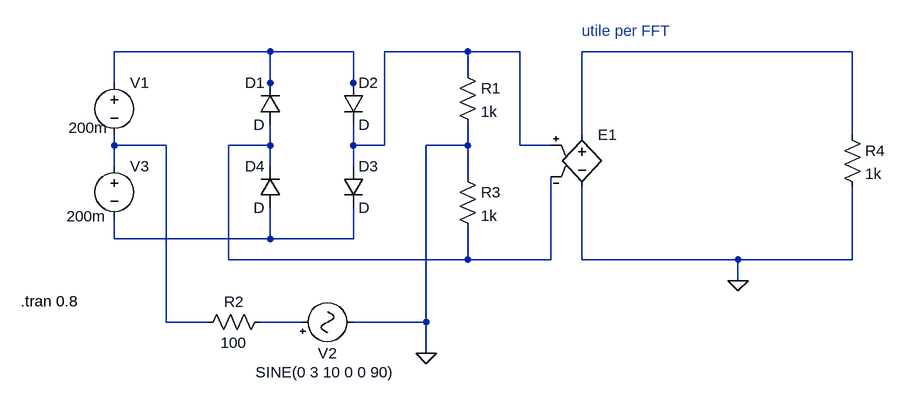
[diagram p0: schematic mod_anello_dopp_basic.asc]
mod_anello_dopp_basic.asc, the LTspice schematic file:
Version 4
SHEET 1 1172 680
WIRE 208 -48 -32 -48
WIRE 336 -48 208 -48
WIRE 512 -48 384 -48
WIRE 592 -48 512 -48
WIRE 1104 -48 688 -48
WIRE 512 -16 512 -48
WIRE -32 0 -32 -48
WIRE 208 0 208 -48
WIRE 336 0 336 -48
WIRE 208 16 208 0
WIRE 336 16 336 0
WIRE 688 80 688 -48
WIRE 1104 80 1104 -48
WIRE -32 96 -32 80
WIRE 48 96 -32 96
WIRE 208 96 208 64
WIRE 208 96 144 96
WIRE 336 96 336 64
WIRE 384 96 384 -48
WIRE 384 96 336 96
WIRE 512 96 512 64
WIRE 512 96 448 96
WIRE 592 96 592 -48
WIRE 640 96 592 96
WIRE -32 128 -32 96
WIRE 208 128 208 96
WIRE 336 128 336 96
WIRE 512 144 512 96
WIRE -32 240 -32 208
WIRE 208 240 208 192
WIRE 208 240 -32 240
WIRE 336 240 336 192
WIRE 336 240 208 240
WIRE 144 272 144 96
WIRE 512 272 512 224
WIRE 512 272 144 272
WIRE 640 272 640 144
WIRE 640 272 512 272
WIRE 688 272 688 160
WIRE 928 272 688 272
WIRE 1104 272 1104 160
WIRE 1104 272 928 272
WIRE 928 304 928 272
WIRE 48 368 48 96
WIRE 112 368 48 368
WIRE 256 368 192 368
WIRE 448 368 448 96
WIRE 448 368 336 368
WIRE 448 416 448 368
FLAG 448 416 0
FLAG 928 304 0
SYMBOL voltage -32 -16 R0
WINDOW 123 0 0 Left 2
WINDOW 39 -70 113 Left 2
WINDOW 3 -70 85 Left 2
SYMATTR Value 200m
SYMATTR InstName V1
SYMBOL diode 224 64 R180
WINDOW 0 24 64 Left 2
WINDOW 3 24 0 Left 2
SYMATTR InstName D1
SYMBOL diode 320 0 R0
SYMATTR InstName D2
SYMBOL diode 320 128 R0
SYMATTR InstName D3
SYMBOL diode 224 192 R180
WINDOW 0 24 64 Left 2
WINDOW 3 24 0 Left 2
SYMATTR InstName D4
SYMBOL res 208 352 R90
WINDOW 0 0 56 VBottom 2
WINDOW 3 32 56 VTop 2
SYMATTR InstName R2
SYMATTR Value 100
SYMBOL res 496 128 R0
SYMATTR InstName R3
SYMATTR Value 1k
SYMBOL voltage -32 112 R0
WINDOW 3 -73 93 Left 2
WINDOW 123 0 0 Left 2
WINDOW 39 -73 121 Left 2
SYMATTR Value 200m
SYMATTR InstName V3
SYMBOL res 496 -32 R0
SYMATTR InstName R1
SYMATTR Value 1k
SYMBOL Misc\\signal 240 368 R270
WINDOW 0 -32 56 VBottom 2
WINDOW 3 -93 52 VTop 2
WINDOW 123 0 0 Left 2
WINDOW 39 0 0 Left 2
SYMATTR InstName V2
SYMATTR Value SINE(0 3 10 0 0 90)
SYMBOL res 1088 64 R0
SYMATTR InstName R4
SYMATTR Value 1k
SYMBOL e 688 64 R0
SYMATTR InstName E1
SYMATTR Value ""
SYMATTR SpiceLine2 1
TEXT -176 336 Left 2 !.tran 0.8
TEXT 688 -80 Left 2 ;utile per FFT

The netlist it stands for:
* mod_anello_dopp_basic.asc
V1 N001 N004 200m
D1 N005 N001 D
D2 N001 N002 D
D3 N002 N006 D
D4 N006 N005 D
R2 N007 N004 100
R3 0 N005 1k
V3 N004 N006 200m
R1 N002 0 1k
V2 N007 0 SINE(0 3 10 0 0 90)
R4 N003 0 1k
E1 N003 0 N002 N005 1
.model D D
.lib standard.dio
.tran 0.8
* utile per FFT
.backanno
.end